# Altium schematic sheet M2-RS485.SchDoc
size A4; ApprovedBy: -; CheckedBy: h.t.t.monfared; Author: h.t.t.monfared; Engineer: h.t.t.monfared; DocumentNumber: 1; Revision: 1.00; SheetNumber: 2; SheetTotal: 10; Project Code:: UFM Sensor Controller; Document Title:: RS485 Sheet
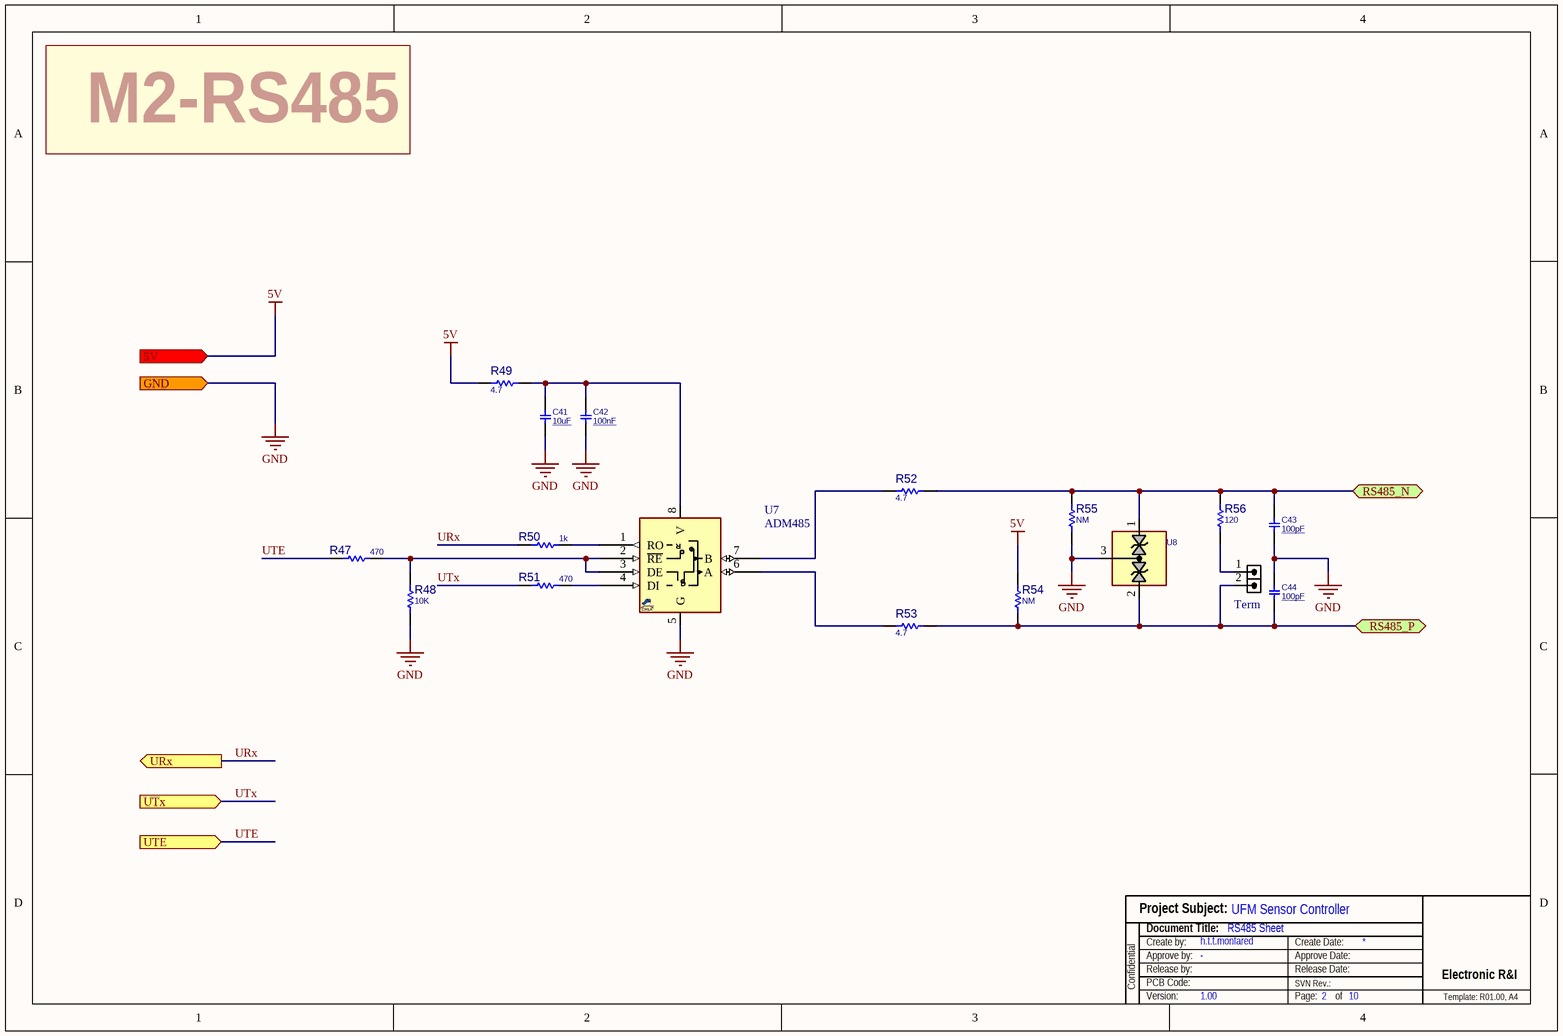
[diagram p0: M2-RS485.SchDoc]

## Parts
C41  10uF  [C1206]
C42  100nF  [C1206]
C43  100pF  [C1206]
C44  100pF  [C1206]
R47  470  [R1206]
R48  10K  [R1206]
R49  4.7  [R1206]
R50  1k  [R1206]
R51  470  [R1206]
R52  4.7  [R1206]
R53  4.7  [R1206]
R54  NM  [R1206]
R55  NM  [R1206]
R56  120  [R1206]
Term  HDRM2  [HDR_M_1X2]  (value not drawn)
U7  ADM485  [SO_8]
U8  CDSOT23-SM712  [SOT23_3]  (value not drawn)

## Ports
5V (in), GND (in), RS485_N (bidir), RS485_P (bidir), URx (out), UTE (in), UTx (in)

## Nets
5V: R49.2 R54.2 ; port 5V
GND: C41.1 C42.1 C43.1 C44.2 R48.1 R55.1 U7.5(G) U8.3(NC) ; port GND
RS485_N: C43.2 R52.2 R55.2 R56.2 U8.1(NC) ; port RS485_N
RS485_P: C44.1 R53.2 R54.1 Term.2 U8.2(GND) ; port RS485_P
URx: R50.1 ; port URx
UTE: R47.1 ; port UTE
UTx: R51.1 ; port UTx
NetC41_2: C41.2 C42.2 R49.1 U7.8(V)
NetR47_2: R47.2 R48.2 U7.2(~{RE}) U7.3(DE)
NetR50_2: R50.2 U7.1(RO)
NetR51_2: R51.2 U7.4(DI)
NetR52_1: R52.1 U7.7(B)
NetR53_1: R53.1 U7.6(A)
NetR56_1: R56.1 Term.1

## Notes on the sheet
- M2-RS485
- Project Subject:
- Confidential
- Release by:
- Document Title:
- Create by:
- PCB Code:
- Approve by:
- SVN Rev.:
- Create Date:
- Release Date:
- Approve Date:
- Electronic R&I
- Version:
- Page:
- of
- Template: R01.00, A4
- (in symbol ADM485_SOP8) R; D

## Library data of the parts
C41-C44 = CAP_SMD_MLCC: CAP, MLCC, 1nF, 50V, C0G, 10%, 0402; MANF_P#: MANF_PART#; MANF: Murata; PARAM: C0G, 10%; PRICE: 100= 1$; DESC: CAP, MLCC, 1nF, 50V, C0G, 10%, 0402; PARAM2: 50V; ASSEMBLY: ASSEMBLY
  C41: VALUE: 10uF
  C42: VALUE: 100nF
  C43 C44: VALUE: 100pF
R47-R56 = RES_SMD: RESISTOR, SMD; PARAM: -W; DESC: DESCRIPTION; DIST#: MOUSER; PARAM2: 1%; MANF_P#: -; MANF: -; ASSEMBLY: ASSEMBLY; PRICE: 100= 0.5$
  R47 R51: VALUE: 470
  R48: VALUE: 10K
  R49 R52 R53: VALUE: 4.7
  R50: VALUE: 1k
  R54 R55: VALUE: NM
  R56: VALUE: 120
Term = HDR_M_1X2: CONN, HEADER, Male, pitch: 2.54mm, 2POS; VALUE: HDRM2
U7 = ADM485_SOP8: RS-485 Transceiver, 5V, SOP-8, ±7V Ground Difference Between Devices on the Bus; MANF_P#: ADM485AR; MANF: Analog Devices; PRICE: 4000toman@PAYA; VALUE: ADM485
U8 = TVS_X2_CDSOT23-SM712: TVS, ESD PROTECT, 2CH, 400W/17A PP, 7.5VBR, ±8KV ESDmin; MANF: Bourns; PARAM: 400W/17A peak-pulse; MANF_P#: CDSOT23-SM712; PARAM2: 7.5VBR, ±8KV ESD min; PRICE: 1.6$; VALUE: CDSOT23-SM712